# EAGLE design GrblPi B+ (EAGLE 6.4)
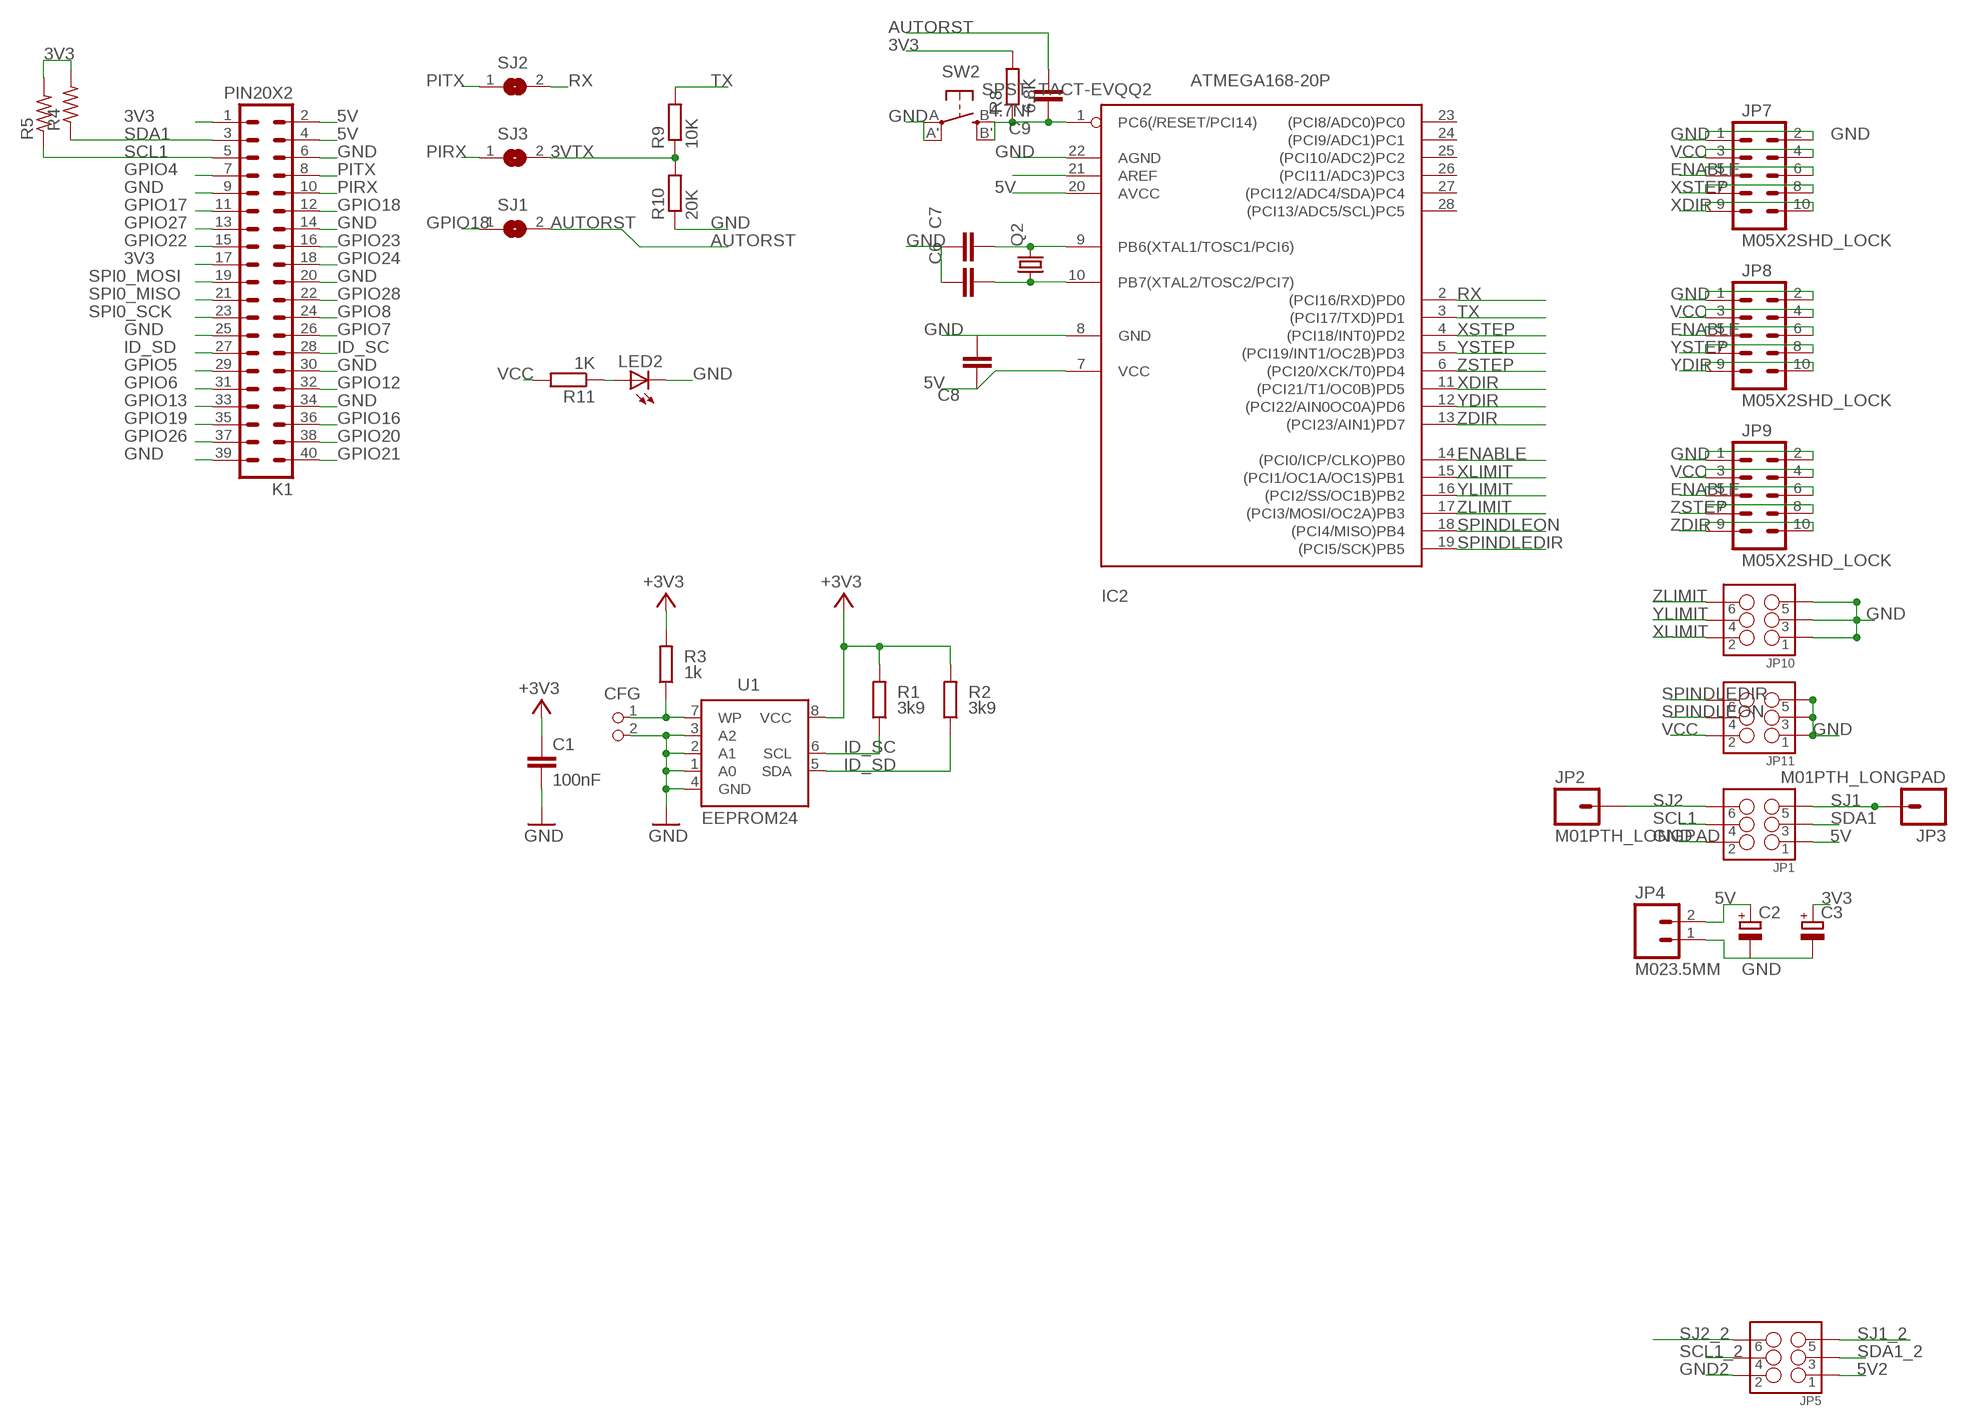
[diagram p0: schematic, sheet 1, part 1 of 2]
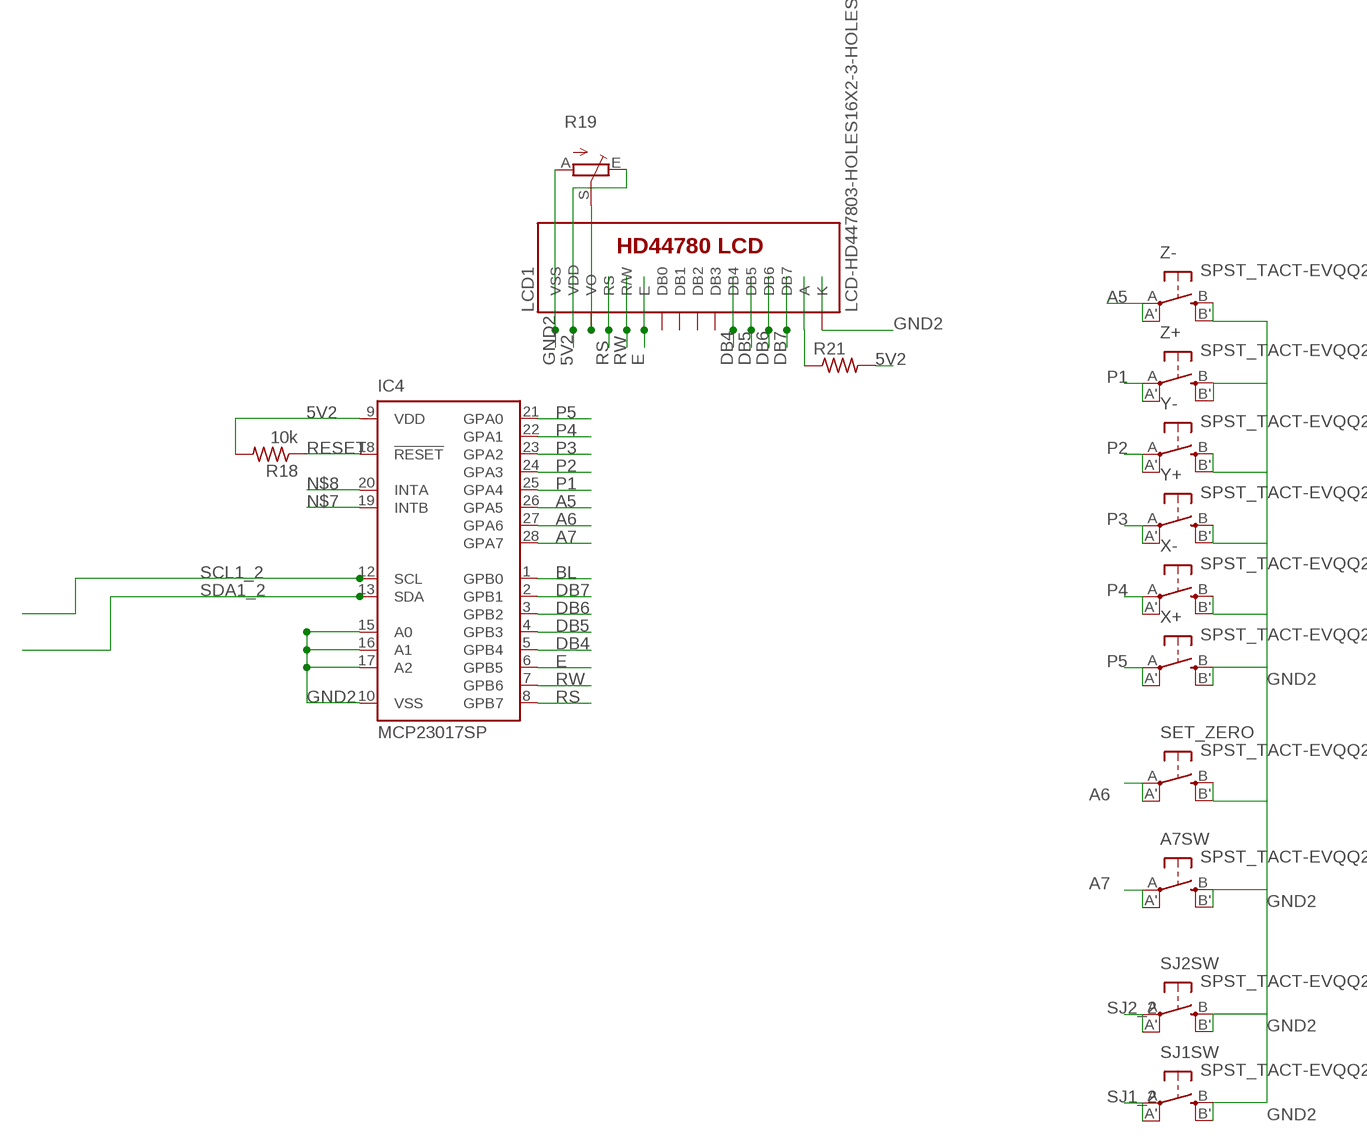
[diagram p1: schematic, sheet 1, part 2 of 2]

## Parts
A7SW  SPST_TACT-EVQQ2  [EVQ-Q2]
C1  100nF  C-EUC1206  [C1206]
C2  CPOL-EU153CLV-0405  [153CLV-0405]
C3  CPOL-EU153CLV-0405  [153CLV-0405]
C6  CAPACITOR_NPOL-1206  [C1206]
C7  CAPACITOR_NPOL-1206  [C1206]
C8  CAPACITOR_NPOL-1206  [C1206]
C9  4.7Nf  CAPACITOR_NPOL-1206  [C1206]
CFG  PIN2_100  [PIN_W_2]
IC2  ATMEGA168-20P  [DIL28-3]
IC4  MCP23017SP  [DIL28-3]
JP1  M03X2SHROUD  [2X3-SHROUDED]
JP2  M01PTH_LONGPAD  [1X01_LONGPAD]
JP3  M01PTH_LONGPAD  [1X01_LONGPAD]
JP4  M023.5MM  [SCREWTERMINAL-3.5MM-2]
JP5  M03X2SHROUD  [2X3-SHROUDED]
JP7  M05X2SHD_LOCK  [2X5-SHROUDED_LOCK]
JP8  M05X2SHD_LOCK  [2X5-SHROUDED_LOCK]
JP9  M05X2SHD_LOCK  [2X5-SHROUDED_LOCK]
JP10  M03X2SHROUD  [2X3-SHROUDED]
JP11  M03X2SHROUD  [2X3-SHROUDED]
K1  PIN20X2  [PIN_20X2]
LCD1  LCD-HD447803-HOLES16X2-3-HOLES  [LCD-16X2-3HOLES]
LED2  LEDCHIPLED_1206  [CHIPLED_1206]
Q2  CRYSTALHC49UP  [HC49UP]
R1  3k9  R-EU_M1206  [M1206]
R2  3k9  R-EU_M1206  [M1206]
R3  1k  R-EU_M1206  [M1206]
R4  R-US_M1206  [M1206]
R5  R-US_M1206  [M1206]
R8  6.8K  RESISTOR-1206  [R1206]
R9  10K  RESISTOR-1206  [R1206]
R10  20K  RESISTOR-1206  [R1206]
R11  1K  RESISTOR-1206  [R1206]
R18  10k  R-US_M1206  [M1206]
R19  TRIM_EU-CA6V  [CA6V]
R21  R-US_M1206  [M1206]
SET_ZERO  SPST_TACT-EVQQ2  [EVQ-Q2]
SJ1  SJ  [SJ]
SJ1SW  SPST_TACT-EVQQ2  [EVQ-Q2]
SJ2  SJ  [SJ]
SJ2SW  SPST_TACT-EVQQ2  [EVQ-Q2]
SJ3  SJ  [SJ]
SW2  SPST_TACT-EVQQ2  [EVQ-Q2]
U1  EEPROM24  [SOIC8]
X+  SPST_TACT-EVQQ2  [EVQ-Q2]
X-  SPST_TACT-EVQQ2  [EVQ-Q2]
Y+  SPST_TACT-EVQQ2  [EVQ-Q2]
Y-  SPST_TACT-EVQQ2  [EVQ-Q2]
Z+  SPST_TACT-EVQQ2  [EVQ-Q2]
Z-  SPST_TACT-EVQQ2  [EVQ-Q2]

## Nets
3V3: C3.+ K1.1 K1.17 R4.2 R5.2 R8.2
3VTX: R9.1 R10.2 SJ3.2
5V: C2.+ C8.1 IC2.7(VCC) IC2.20(AVCC) JP1.1 JP4.2 K1.2 K1.4
5V2: IC4.9(VDD) JP5.1 LCD1.2(VDD) R18.2 R19.E R21.2
+3V3: C1.1 R1.2 R2.2 R3.2 U1.8(VCC)
A5: IC4.26(GPA5) Z-.A'(P1) Z-.A(P)
A6: IC4.27(GPA6) SET_ZERO.A'(P1) SET_ZERO.A(P)
A7: A7SW.A'(P1) A7SW.A(P) IC4.28(GPA7)
AUTORST: C9.2 SJ1.2
BL: IC4.1(GPB0)
DB4: IC4.5(GPB4) LCD1.11(DB4)
DB5: IC4.4(GPB3) LCD1.12(DB5)
DB6: IC4.3(GPB2) LCD1.13(DB6)
DB7: IC4.2(GPB1) LCD1.14(DB7)
E: IC4.6(GPB5) LCD1.6(E)
ENABLE: IC2.14((PCI0/ICP/CLKO)PB0) JP7.5 JP7.6 JP8.5 JP8.6 JP9.5 JP9.6
GND: C1.2 C2.- C3.- C6.1 C7.1 C8.2 CFG.2 IC2.8(GND) IC2.22(AGND) JP1.2 JP4.1 JP7.1 JP7.2 JP8.1 JP8.2 JP9.1 JP9.2 JP10.1 JP10.3 JP10.5 JP11.1 JP11.3 JP11.5 K1.6 K1.9 K1.14 K1.20 K1.25 K1.30 K1.34 K1.39 LED2.C R10.1 SW2.A'(P1) SW2.A(P) U1.1(A0) U1.2(A1) U1.3(A2) U1.4(GND)
GND2: A7SW.B'(S1) A7SW.B(S) IC4.10(VSS) IC4.15(A0) IC4.16(A1) IC4.17(A2) JP5.2 LCD1.1(VSS) LCD1.16(K) R19.A SET_ZERO.B'(S1) SET_ZERO.B(S) SJ1SW.B'(S1) SJ1SW.B(S) SJ2SW.B'(S1) SJ2SW.B(S) X+.B'(S1) X+.B(S) X-.B'(S1) X-.B(S) Y+.B'(S1) Y+.B(S) Y-.B'(S1) Y-.B(S) Z+.B'(S1) Z+.B(S) Z-.B'(S1) Z-.B(S)
GPIO4: K1.7
GPIO5: K1.29
GPIO6: K1.31
GPIO7: K1.26
GPIO8: K1.24
GPIO12: K1.32
GPIO13: K1.33
GPIO16: K1.36
GPIO17: K1.11
GPIO18: K1.12 SJ1.1
GPIO19: K1.35
GPIO20: K1.38
GPIO21: K1.40
GPIO22: K1.15
GPIO23: K1.16
GPIO24: K1.18
GPIO26: K1.37
GPIO27: K1.13
GPIO28: K1.22
ID_SC: K1.28 R1.1 U1.6(SCL)
ID_SD: K1.27 R2.1 U1.5(SDA)
MCURESET1: C9.1 IC2.1(PC6(/RESET/PCI14)) R8.1 SW2.B'(S1) SW2.B(S)
N$3: CFG.1 R3.1 U1.7(WP)
N$7: IC4.19(INTB)
N$8: IC4.20(INTA)
N$11: LCD1.3(VO) R19.S
N$12: LCD1.15(A) R21.1
N$13: IC2.21(AREF)
N$14: LED2.A R11.1
P1: IC4.25(GPA4) Z+.A'(P1) Z+.A(P)
P2: IC4.24(GPA3) Y-.A'(P1) Y-.A(P)
P3: IC4.23(GPA2) Y+.A'(P1) Y+.A(P)
P4: IC4.22(GPA1) X-.A'(P1) X-.A(P)
P5: IC4.21(GPA0) X+.A'(P1) X+.A(P)
PIRX: K1.10 SJ3.1
PITX: K1.8 SJ2.1
RESET: IC4.18(!RESET) R18.1
RS: IC4.8(GPB7) LCD1.4(RS)
RW: IC4.7(GPB6) LCD1.5(R/W)
RX: IC2.2((PCI16/RXD)PD0) SJ2.2
SCL1: JP1.4 K1.5 R5.1
SCL1_2: IC4.12(SCL) JP5.4
SDA1: JP1.3 K1.3 R4.1
SDA1_2: IC4.13(SDA) JP5.3
SJ1: JP1.5 JP3.1
SJ1_2: JP5.5 SJ1SW.A'(P1) SJ1SW.A(P)
SJ2: JP1.6 JP2.1
SJ2_2: JP5.6 SJ2SW.A'(P1) SJ2SW.A(P)
SPI0_MISO: K1.21
SPI0_MOSI: K1.19
SPI0_SCK: K1.23
SPINDLEDIR: IC2.19((PCI5/SCK)PB5) JP11.6
SPINDLEON: IC2.18((PCI4/MISO)PB4) JP11.4
TX: IC2.3((PCI17/TXD)PD1) R9.2
VCC: JP7.3 JP7.4 JP8.3 JP8.4 JP9.3 JP9.4 JP11.2 R11.2
XDIR: IC2.11((PCI21/T1/OC0B)PD5) JP7.9 JP7.10
XLIMIT: IC2.15((PCI1/OC1A/OC1S)PB1) JP10.2
XSTEP: IC2.4((PCI18/INT0)PD2) JP7.7 JP7.8
XTAL3: C6.2 IC2.10(PB7(XTAL2/TOSC2/PCI7)) Q2.1
XTAL4: C7.2 IC2.9(PB6(XTAL1/TOSC1/PCI6)) Q2.2
YDIR: IC2.12((PCI22/AIN0OC0A)PD6) JP8.9 JP8.10
YLIMIT: IC2.16((PCI2/SS/OC1B)PB2) JP10.4
YSTEP: IC2.5((PCI19/INT1/OC2B)PD3) JP8.7 JP8.8
ZDIR: IC2.13((PCI23/AIN1)PD7) JP9.9 JP9.10
ZLIMIT: IC2.17((PCI3/MOSI/OC2A)PB3) JP10.6
ZSTEP: IC2.6((PCI20/XCK/T0)PD4) JP9.7 JP9.8
Unconnected: IC2.23((PCI8/ADC0)PC0) IC2.24((PCI9/ADC1)PC1) IC2.25((PCI10/ADC2)PC2) IC2.26((PCI11/ADC3)PC3) IC2.27((PCI12/ADC4/SDA)PC4) IC2.28((PCI13/ADC5/SCL)PC5) LCD1.7(DB0) LCD1.8(DB1) LCD1.9(DB2) LCD1.10(DB3)

## Library data of the parts
A7SW SET_ZERO SJ1SW SJ2SW SW2 X+ X- Y+ Y- Z+ Z- = adafruit:SPST_TACT: SMT 6mm switch, EVQQ2 series http://www.ladyada.net/library/eagle
C1 = resistor:C-EU: CAPACITOR, European symbol; DIELECTRIC: X7R
C2 C3 = rcl:CPOL-EU: POLARIZED CAPACITOR, European symbol
C6-C9 = dp_devices:CAPACITOR_NPOL: Non-Polarized capacitor in various packages
CFG = FLYFISH:PIN2
IC2 = adafruit:ATMEGA168*P: MICROCONTROLLER 16 kBytes FLASH 1 kBytes SRAM 512 Bytes EEPROM USART 8-channel 10 bit ADC
IC4 = adafruit:MCP23017: http://ww1.microchip.com/downloads/en/DeviceDoc/21952a.pdf Source: http://ww1.microchip.com/downloads/en/DeviceDoc/21952a.pdf
JP1 JP5 JP10 JP11 = SparkFun-Connectors:M03X2: 2x3 .1" header. Shrouded, with keying- CONN-10681 SMT- CONN-11415 Pogo pins- HW-11044; PROD_ID: CONN-10681
JP2 JP3 = SparkFun-Connectors:M01: Header 1 Standard 1-pin 0.1" header. Use with straight break away headers (SKU : PRT-00116), right angle break away headers (PRT-00553), swiss pins (PRT-00743), machine pins (PRT-00117), and female headers (PRT-00115).
JP4 = SparkFun-Connectors:M02: Standard 2-pin 0.1" header. Use with - straight break away headers ( PRT-00116) - right angle break away headers (PRT-00553) - swiss pins (PRT-00743) - machine pins (PRT-00117) - female headers (PRT-00115) Molex polarized connector foot print use with: PRT-08233 with associated crimp pins and housings. 2.54_SCREWTERM for use with PRT-10571. 3.5mm Screw Terminal footprints for PRT-08084 5mm Screw Terminal footprints for use with PRT-08433
JP7-JP9 = SparkFun-Connectors:M05X2: Header 5x2 Standard 10-pin dual row 0.1" header. Commonly used with AVR-ISP. Use with Spark Fun Electronics SKU: PRT-00778
K1 = FLYFISH:PIN20X2
LCD1 = HD44780LCD:LCD-HD44780
LED2 = adafruit:LED: LED OSRAM: - CHIPLED LG R971, LG N971, LY N971, LG Q971, LY Q971, LO R971, LY R971 LH N974, LH R974 LS Q976, LO Q976, LY Q976 LO Q996 - Hyper CHIPLED LW Q18S LB Q993, LB Q99A, LB R99A - SideLED LS A670, LO A670, LY A670, LG A670, LP A670 LB A673, LV A673, LT A673, LW A673 LH A674 LY A675 LS A676, LA A676, LO A676, LY A676, LW A676 LS A679, LY A679, LG A679 - Hyper Micro SIDELED® LS Y876, LA Y876, LO Y876, LY Y876 LT Y87S - SmartLED LW L88C, LW L88S LB L89C, LB L89S, LG L890 LS L89K, LO L89K, LY L89K LS L896, LA L896, LO L896, LY L896 - TOPLED LS T670, LO T670, LY T670, LG T670, LP T670 LSG T670, LSP T670, LSY T670, LOP T670, LYG T670 LG T671, LOG T671, LSG T671 LB T673, LV T673, LT T673, LW T673 LH T674 LS T676, LA T676, LO T676, LY T676, LB T676, LH T676, LSB T676, LW T676 LB T67C, LV T67C, LT T67C, LS T67K, LO T67K, LY T67K, LW E67C LS E67B, LA E67B, LO E67B, LY E67B, LB E67C, LV E67C, LT E67C LW T67C LS T679, LY T679, LG T679 LS T770, LO T770, LY T770, LG T770, LP T770 LB T773, LV T773, LT T773, LW T773 LH T774 LS E675, LA E675, LY E675, LS T675 LS T776, LA T776, LO T776, LY T776, LB T776 LHGB T686 LT T68C, LB T68C - Hyper Mini TOPLED® LB M676 - Mini TOPLED Santana® LG M470 LS M47K, LO M47K, LY M47K Source: http://www.osram.convergy.de/
Q2 = adafruit:CRYSTAL: CRYSTAL; OC_FARNELL: unknown; OC_NEWARK: unknown
R1-R3 = resistor:R-EU_: RESISTOR, European symbol; TOLERANCE: 5%
R4 R5 R18 R21 = adafruit:R-US_: RESISTOR, American symbol
R8-R11 = dp_devices:RESISTOR
R19 = pot:TRIM_EU-: POTENTIOMETER
SJ1-SJ3 = jumper:SJ: SMD solder JUMPER
U1 = FLYFISH:EEPROM24

## Board
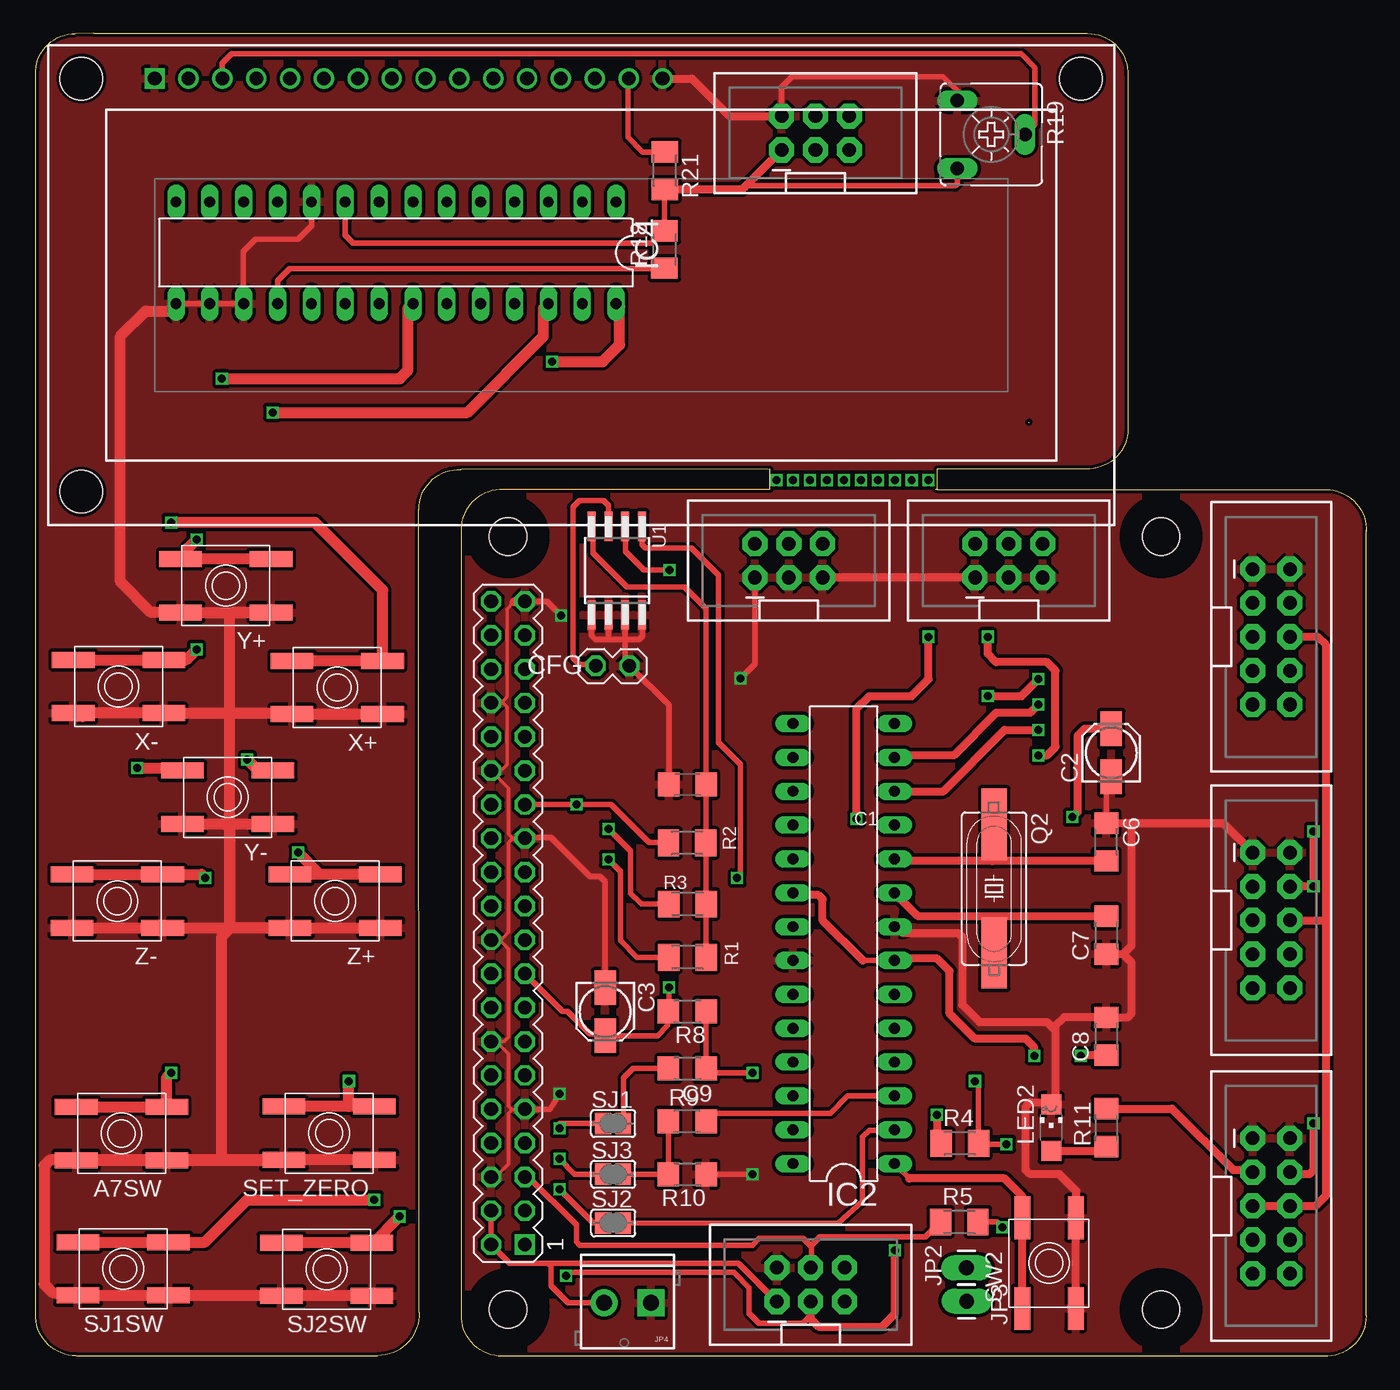
[diagram p2: board, top side]
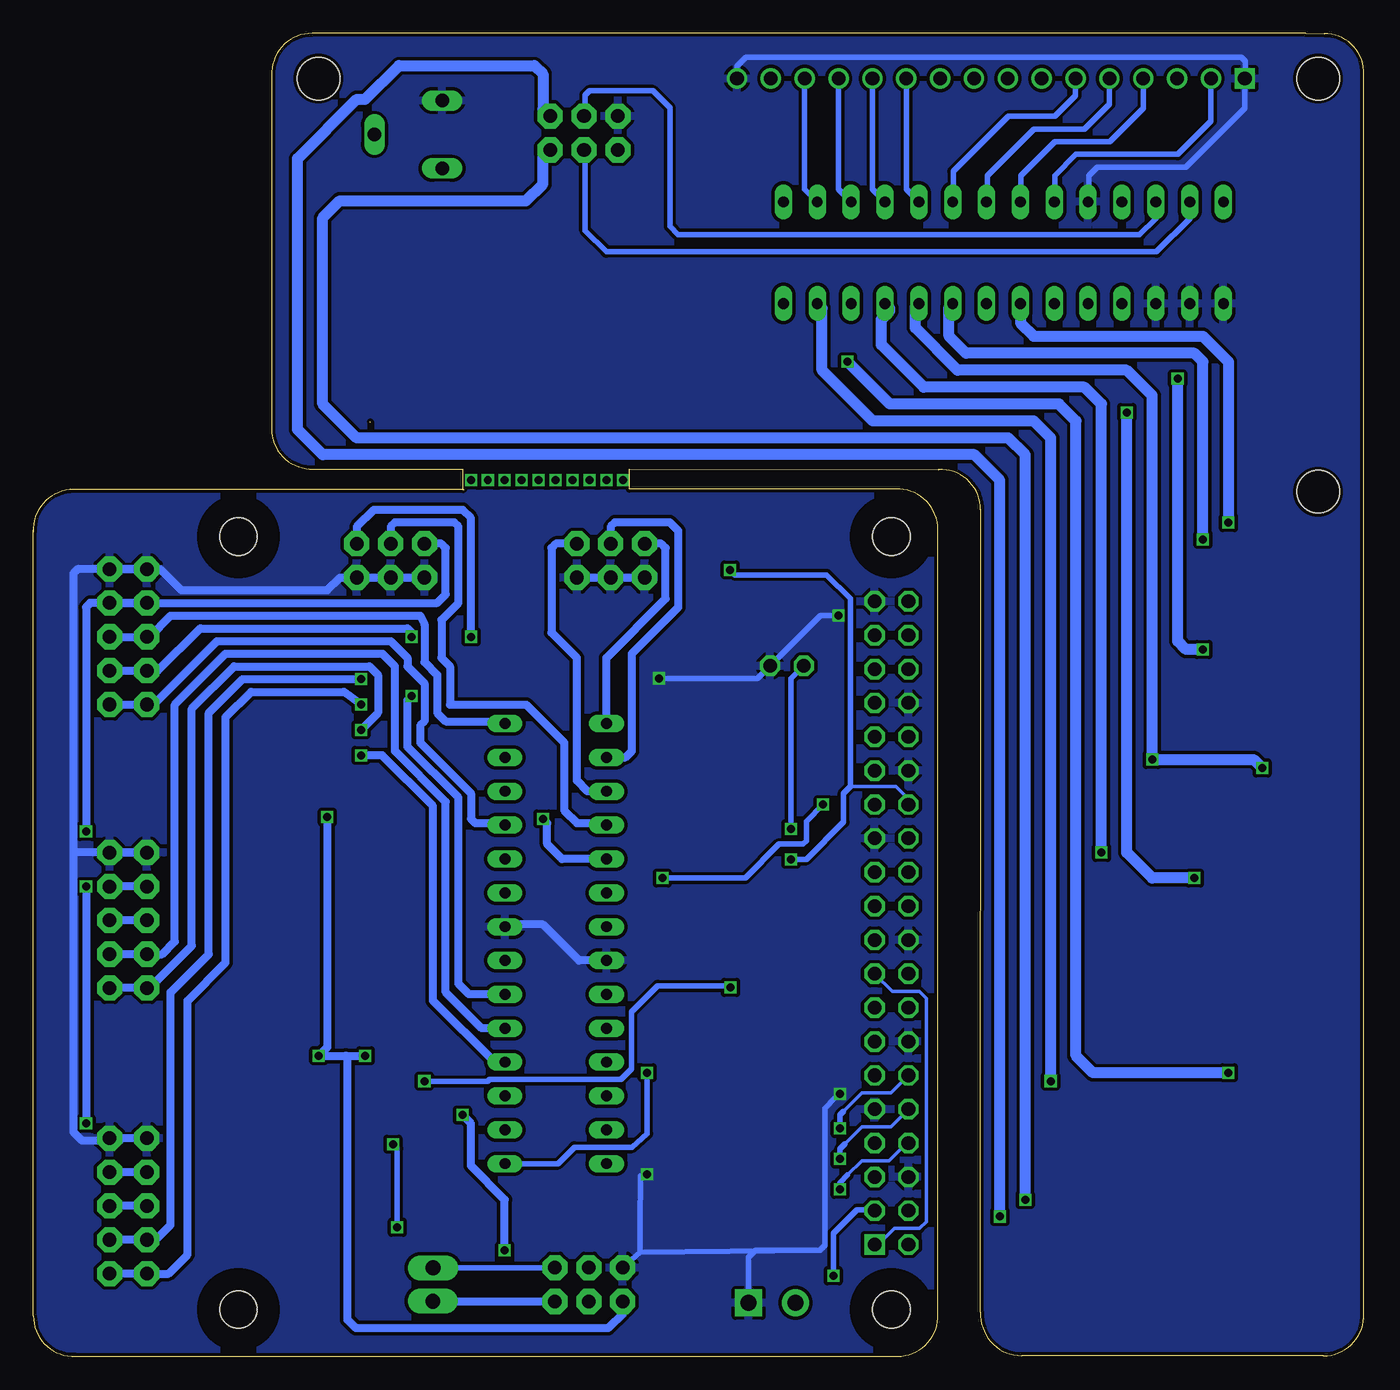
[diagram p3: board, bottom side, seen from below]

Size 99.82 x 99.25 mm. Coordinates in mm from the lower left corner, seen from the top.
Outline: 96.79,65.02 96.8,65.02 arc-93 99.82,61.85
Outline: 99.82,61.85 99.82,3.02 arc-93 96.67,0
Outline: 99.82,61.85 99.82,62
Outline: 96.83,0 96.67,0
Outline: 96.67,0 34.98,0
Outline: 34.98,0 34.92,0
Outline: 31.95,3.15 31.95,62.03 arc-93 35.1,65.05
Outline: 31.95,3 31.95,3.15
Outline: 34.98,0 arc-93 31.95,3.15
Outline: 3.02,0.04 arc-93 0,3.19
Outline: 0,3.18 0,96.18
Outline: 0,96.18 arc-93 2.97,99.23
Outline: 28.75,3.3 arc-93 25.67,0.04
Outline: 3.02,0.04 25.67,0.04
Outline: 28.76,3.29 28.75,63.52
Outline: 74.5,70.05 74.54,70.09
Outline: 4.36,99.25 2.97,99.23
Outline: 78.91,99.25 arc-93 81.93,96.09
Outline: 4.37,99.25 78.91,99.25
Outline: 78.91,99.25 78.91,99.25
Outline: 81.95,69.6 arc-93 78.79,66.57
Outline: 81.94,96.1 81.95,96.1 81.95,69.57
Outline: 78.75,66.57 67.62,66.57 67.62,65.02 67.51,65.02
Outline: 67.62,65.02 96.8,65.02 96.79,65.02
Outline: 35.11,65.05 55.09,65.05 55.09,66.55
Outline: 55.09,66.54 31.9,66.53 31.9,66.53
Outline: 28.75,63.51 arc-93 31.9,66.53
Copper layers (1*16): Top 0.035mm / dielectric 1.5mm / Bottom 0.035mm
Design rules "ITEADstudio_DRC *": minimum track width 6mil, minimum drill 12mil, track to track 10mil, track to pad 10mil, pad to pad 10mil, via to via 10mil, smd to smd 0mil, copper to edge 10mil, drill to drill 10mil, minimum pad ring 10mil, minimum via ring 6mil, stop-mask expansion 2mil, vias tented up to drill 100mil, thermal gap 10mil
Holes 2.8 mm at 84.44,3.5 35.44,3.5 35.44,61.5 84.44,61.5
tRestrict: area 33.9,2 to 37,5; area 33.9,60 to 37,63; area 82.9,60 to 86,63; area 82.9,2 to 86,5
bRestrict: area 82.9,2 to 86,5; area 33.9,2 to 37,5; area 82.9,60 to 86,63; area 33.9,60 to 37,63

### Footprints (pad centres in the part's own frame; a part is rotated, then mirrored left to right if it is on the bottom)
EVQ-Q2 = smd 3.2 x 1.2: A -3.4,-2; A' 3.4,-2; B -3.4,2; B' 3.4,2
C1206 = smd 1.6 x 1.8: 1 -1.4,0; 2 1.4,0
153CLV-0405 = smd 2.6 x 1.6: + 1.8,0; - -1.8,0
C1206' = smd 1.6 x 1.803: 1 -1.422,0; 2 1.422,0
PIN_W_2 = drill 1.016 octagon: 1 0,0; 2 0,-2.54
DIL28-3 = drill 0.813 long: 1 -16.51,-3.81; 2 -13.97,-3.81; 3 -11.43,-3.81; 4 -8.89,-3.81; 5 -6.35,-3.81; 6 -3.81,-3.81; 7 -1.27,-3.81; 8 1.27,-3.81; 9 3.81,-3.81; 10 6.35,-3.81; 11 8.89,-3.81; 12 11.43,-3.81; 13 13.97,-3.81; 14 16.51,-3.81; 15 16.51,3.81; 16 13.97,3.81; 17 11.43,3.81; 18 8.89,3.81; 19 6.35,3.81; 20 3.81,3.81; 21 1.27,3.81; 22 -1.27,3.81; 23 -3.81,3.81; 24 -6.35,3.81; 25 -8.89,3.81; 26 -11.43,3.81; 27 -13.97,3.81; 28 -16.51,3.81
2X3-SHROUDED = drill 1.016 pad 1.88 octagon: 1 -1.27,2.54; 2 1.27,2.54; 3 -1.27,0; 4 1.27,0; 5 -1.27,-2.54; 6 1.27,-2.54
1X01_LONGPAD = drill 1.118 pad 1.88 long: 1 0,0
SCREWTERMINAL-3.5MM-2 = drill 1.2 pad 2.032 square: 1 0,0 | drill 1.2 pad 2.032: 2 3.5,0
2X5-SHROUDED_LOCK = drill 1.016 pad 1.88 octagon: 1 -1.397,5.08; 2 1.397,5.08; 3 -1.397,2.54; 4 1.397,2.54; 5 -1.397,0; 6 1.397,0; 7 -1.397,-2.54; 8 1.397,-2.54; 9 -1.397,-5.08; 10 1.397,-5.08
PIN_20X2 = drill 1.016 square: 1 -24.13,-1.27 | drill 1.016 octagon: 2 -24.13,1.27; 3 -21.59,-1.27; 4 -21.59,1.27; 5 -19.05,-1.27; 6 -19.05,1.27; 7 -16.51,-1.27; 8 -16.51,1.27; 9 -13.97,-1.27; 10 -13.97,1.27; 11 -11.43,-1.27; 12 -11.43,1.27; 13 -8.89,-1.27; 14 -8.89,1.27; 15 -6.35,-1.27; 16 -6.35,1.27; 17 -3.81,-1.27; 18 -3.81,1.27; 19 -1.27,-1.27; 20 -1.27,1.27; 21 1.27,-1.27; 22 1.27,1.27; 23 3.81,-1.27; 24 3.81,1.27; 25 6.35,-1.27; 26 6.35,1.27; 27 8.89,-1.27; 28 8.89,1.27; 29 11.43,-1.27; 30 11.43,1.27; 31 13.97,-1.27; 32 13.97,1.27; 33 16.51,-1.27; 34 16.51,1.27; 35 19.05,-1.27; 36 19.05,1.27; 37 21.59,-1.27; 38 21.59,1.27; 39 24.13,-1.27; 40 24.13,1.27
LCD-16X2-3HOLES = drill 1.016 square: 1 -32,15.5 | drill 1.016: 2 -29.46,15.5; 3 -26.92,15.5; 4 -24.38,15.5; 5 -21.84,15.5; 6 -19.3,15.5; 7 -16.76,15.5; 8 -14.22,15.5; 9 -11.68,15.5; 10 -9.14,15.5; 11 -6.6,15.5; 12 -4.06,15.5; 13 -1.52,15.5; 14 1.02,15.5; 15 3.56,15.5; 16 6.1,15.5 | hole 3.2: -37.5,15.5; -37.5,-15.5; 37.5,15.5
CHIPLED_1206 = smd 1.5 x 1.5: A 0,-1.75; C 0,1.75
HC49UP = smd 5.334 x 1.93: 1 -4.826,0; 2 4.826,0
M1206 = smd 1.6 x 2: 1 -1.4,0; 2 1.4,0
R1206 = smd 1.6 x 1.803: 1 -1.422,0; 2 1.422,0
CA6V = drill 1.016 long: A -2.54,-2.54; E 2.54,-2.54; S 0,2.54
SJ = smd 1.168 x 1.6: 1 -0.762,0; 2 0.762,0
SOIC8 = smd 0.6 x 2.2: 1 -1.905,-3.33; 2 -0.635,-3.33; 3 0.635,-3.33; 4 1.905,-3.33; 5 1.905,3.33; 6 0.635,3.33; 7 -0.635,3.33; 8 -1.905,3.33

### Placement (x,y rotation side)
A7SW  6.44,16.71 180 top
C1  48.91,42.91 180 top
C2  80.7,45.28 90 top
C3  42.72,25.84 270 top
C6  [C1206']  80.31,38.58 270 top
C7  [C1206']  80.31,31.59 90 top
C8  [C1206']  80.31,24 90 top
C9  4.7Nf  [C1206']  48.88,21.59 180 top
CFG  42.01,51.8 90 top
IC2  60.63,30.96 90 top
IC4  27.04,82.79 180 top
JP1  58.14,5.37 90 top
JP2  69.83,6.62 90 top
JP3  69.85,4.13 270 top
JP4  46.15,4 180 top
JP5  58.5,91.77 90 top
JP7  92.7,53.97 0 top
JP8  92.7,32.7 0 top
JP9  92.7,11.27 0 top
JP10  56.5,59.69 90 top
JP11  73.01,59.69 90 top
K1  35.44,32.5 90 top
LCD1  40.93,80.36 0 top
LED2  76.19,17.14 0 top
Q2  71.9,35.08 270 top
R1  48.9,29.93 0 top
R2  48.88,38.51 0 top
R3  48.9,33.93 0 top
R4  69.34,15.97 0 top
R5  69.29,10.07 0 top
R8  48.88,25.88 180 top
R9  48.88,17.62 0 top
R10  48.88,13.65 180 top
R11  80.31,17.14 90 top
R18  47.17,83.03 90 top
R19  71.69,91.67 270 top
R21  47.21,88.95 270 top
SET_ZERO  22.02,16.73 180 top
SJ1  43.33,17.46 0 top
SJ1SW  6.57,6.55 180 top
SJ2  43.33,10 0 top
SJ2SW  21.83,6.53 180 top
SJ3  43.33,13.65 0 top
SW2  76.03,6.99 90 top
U1  43.6,58.94 0 top
X+  22.63,50.17 180 top
X-  6.21,50.25 180 top
Y+  14.27,57.81 180 top
Y-  14.4,41.93 180 top
Z+  22.47,34.15 180 top
Z-  6.13,34.15 180 top

### Tracks (layer width: path | path; a pad name or v marks a point on that pad's centre or on a via)
3V3  (via drill 0.6)
  Top 0.406: K1.17 39.52,25.88 39.9,25.88 41.58,24.19 42.57,24.19 C3.+ 46.64,24.04 47.42,24.83 47.42,25.84 R8.2 47.51,25.93 v47.51,27.67 | v72.84,15.9 70.81,15.9 R4.2 70.74,20.38 v70.48,20.64 | R5.2 72.11,10.07 v72.52,9.67
  Bottom 0.254: K1.1 36.45,8.37 35.23,9.59 33.33,9.59 32.82,10.1 32.82,26.86 33.33,27.37 35.38,27.37 K1.17
  Bottom 0.406: 72.47,9.82 72.52,9.54 v72.52,9.67 72.52,15.57 v72.84,15.9 | v70.48,20.64 65.74,20.64 65.61,20.77 55.72,20.77 54.93,21.55 54.93,25.85 52.98,27.8 47.64,27.8 v47.51,27.67
3VTX
  Top 0.406: SJ3.2 R10.2 R9.1
5V  (via drill 0.6)
  Top 0.254: K1.2
  Top 0.406: K1.4 K1.2 | K1.2 35.55,6.99 38.41,6.99 | 38.41,6.99 52.72,6.99 | 52.72,6.99 JP1.1 | JP4.2 39.93,4 38.66,5.27 38.66,6.73 38.41,6.99 | IC2.7 62.06,29.69 | 52.72,6.99 52.72,6.96 v55.55,4.13
  Top 0.61: C8.1 78.45,22.58 v78.41,22.54 | v74.92,22.54 74.92,23.18 74.28,23.81 70.47,23.81 68.57,25.72 68.57,28.89 67.61,29.85 64.6,29.85 IC2.7 | 62.06,29.69 59.04,32.7 59.04,34.29 58.73,34.61 56.98,34.61 IC2.20 | C2.+ 78.69,47.08 78.16,46.55 78.16,40.83 v77.78,40.45
  Bottom 0.61: 76.38,22.54 v78.41,22.54 77.78,23.18 v77.78,40.45 | 76.38,22.54 v74.92,22.54 | v55.55,4.13 55.55,3.24 56.69,2.1 75.62,2.1 76.25,2.73 76.25,22.42 76.38,22.54
5V2
  Top 0.406: R21.2 47.17,87.51 R18.2 46.24,83.5 23.81,83.5 23.23,84.09 IC4.9 | R19.E 69.15,87.97 68.99,87.81 53.27,87.81 53.26,87.79
  Top 0.61: R21.2 53.01,87.55 53.26,87.79 JP5.1
  Bottom 0.406: LCD1.2 11.47,92.67 13.97,90.17 21.59,90.17 23.18,88.58 23.18,86.65 IC4.9
+3V3
  Top 0.406: R1.2 R3.2 50.28,33.95 R2.2 50.31,38.54 C1.1 50.31,56.11 48.69,57.72 44.37,57.72 41.83,60.26 41.83,62.13 U1.8
A5  (via drill 0.6)
  Top 0.813: Z-.A' Z-.A 12.43,36.15 v12.7,35.88 | IC4.26 38.1,78.62 38.1,76.52 32.38,70.8 v17.78,70.8
  Bottom 0.813: v12.7,35.88 15.88,35.88 17.78,37.78 v17.78,70.8
A6  (via drill 0.6)
  Top 0.813: 23.5,18.73 SET_ZERO.A' | SET_ZERO.A 23.5,18.73 | 23.5,18.73 v23.5,20.64
  Bottom 0.813: v23.5,20.64 23.5,68.9 24.77,70.17 36.83,70.17 40.64,73.98 40.64,78.62 IC4.27
A7  (via drill 0.6)
  Top 0.813: A7SW.A' A7SW.A 9.84,20.95 v10.16,21.27 | v38.73,74.61 42.55,74.61 43.81,75.88 43.81,78.71 IC4.28
  Bottom 0.813: v10.16,21.27 20.32,21.27 21.59,22.54 21.59,70.17 22.86,71.44 35.56,71.44 v38.73,74.61
AUTORST
  Top 0.406: C9.2 44.82,21.59 44.12,20.89 44.12,17.49 SJ1.2
DB4
  Bottom 0.406: LCD1.11 34.33,87.54 IC4.5
DB5
  Bottom 0.406: LCD1.12 36.87,87.54 IC4.4
DB6
  Bottom 0.406: LCD1.13 39.41,87.54 IC4.3
DB7
  Bottom 0.406: LCD1.14 41.95,87.54 IC4.2
E
  Bottom 0.406: LCD1.6 21.63,94.58 23.18,93.03 26.67,93.03 30.8,88.9 30.8,86.65 IC4.6
ENABLE
  Top 0.61: JP9.5 96.03,11.27 96.83,12.07 96.83,32.7 | 96.83,32.7 96.83,53.34 96.19,53.97 JP7.6 | JP8.6 96.83,32.7
  Bottom 0.61: JP9.5 JP9.6 | JP8.5 JP8.6 | JP7.6 JP7.5 91.11,53.97 89.52,55.56 70.79,55.56 70.47,54.93 70.47,52.07 69.52,51.12 69.52,48.26 68.89,47.63 64.6,47.63 IC2.14
GND  (via drill 0.6)
  Top 0.254: K1.6 34.52,13.45 35.48,14.41 35.48,18.22 35.74,18.48 | 35.74,18.48 36.65,18.48 K1.9 | 35.74,18.48 35.48,18.73 35.48,22.67 34.54,23.61 K1.14 35.15,23.61 35.48,23.94 35.48,30.54 34.8,31.23 K1.20 34.9,31.23 35.48,31.81 35.48,38.54 35.74,38.8 36.65,38.8 K1.25 35.81,38.85 35.48,39.18 35.48,42.61 K1.30 34.9,43.93 35.36,44.39 35.36,48.7 34.98,49.09 34.24,49.09 K1.34 34.9,49.01 35.36,49.47 35.36,56.07 35.87,56.58
  Top 0.406: K1.9 38.58,18.53 v39.29,19.69 | v53.77,13.65 R10.1 | 44.23,53.78 U1.3 44.23,54.18 44.25,53.78 45.26,53.78 45.52,54.04 45.52,55.6 U1.4 | 44.23,53.78 44.23,52.11 CFG.2 47.51,48.84 C1.2 | JP10.1 53.96,51.94 v52.88,50.86 | U1.1 41.69,54.05 41.96,53.78 42.98,53.78 | 42.98,53.78 42.98,55.6 U1.2 42.96,54.18 42.98,53.78 | 42.98,53.78 44.23,53.78 | K1.39 38.35,56.63 v39.42,55.56 | C3.- 42.72,35.62 42.34,36 41.58,36 38.66,38.93 36.78,38.93 K1.25 | C6.1 80.31,43.09 C2.-
  Top 0.61: JP8.1 89.08,40 C6.1 81.91,40 82.22,39.69 82.22,30.8 81.58,30.16 80.32,30.16 C7.1 81.58,30.17 82.22,29.53 82.22,25.72 81.9,25.4 80.34,25.4 C8.2 77.17,25.42 76.5,24.76 76.5,24.45 | 76.5,24.45 76.5,19.21 LED2.C 76.03,19.05 74.6,19.05 74.28,18.73 74.28,13.97 74.6,13.65 76.82,13.65 78.09,12.38 78.09,10.8 78.03,10.73 SW2.A' SW2.A | IC2.8 64.6,32.23 65.08,31.75 69.2,31.75 69.52,31.43 69.52,26.35 70.79,25.08 75.87,25.08 76.5,24.45 | JP11.1 JP10.5 | K1.39 35.92,56.63 35.87,56.58
  Bottom 0.406: v39.29,19.69 39.67,19.37 40.44,18.61 40.44,8.32 40.82,7.94 | 40.82,7.94 54.3,7.81 | 54.3,7.81 JP1.2 | 54.3,7.81 54.3,9.87 54.28,13.53 53.9,13.65 v53.77,13.65 | v52.88,50.86 45.48,50.86 CFG.2 40.78,55.56 v39.42,55.56 | 40.82,7.94 45.64,7.94 46.15,7.43 JP4.1
  Bottom 0.61: JP9.1 93.17,16.35 93.33,16.19 93.94,16.19 JP9.2 94.25,16.19 96.19,16.19 96.83,16.83 96.83,37.78 | JP8.2 JP8.1 96.83,37.78 | JP7.2 JP7.1 | JP7.1 96.51,59.06 96.83,58.74 96.83,37.78 | JP7.1 90.3,59.06 88.71,57.47 77.78,57.47 76.82,58.42 JP11.5 JP11.3 JP11.1 | IC2.22 58.88,29.69 61.58,32.39 64.28,32.39 IC2.8 | JP10.5 JP10.3 JP10.1
  pour Bottom: 32.38,65.72 99.06,65.72 101.28,63.5 101.28,1.59 98.74,-0.95 33.66,-0.95 30.8,1.91 30.8,64.14
  pour Top: 32.07,65.72 98.74,65.72 100.65,63.82 100.65,1.27 98.42,-0.95 33.02,-0.95 30.8,1.27 30.8,64.45
GND2
  Top 0.406: IC4.10 20.69,84.82 19.68,83.82 16.51,83.82 15.56,82.87 15.56,79.03 IC4.17 IC4.16 IC4.15 | JP5.2 55.96,95.22 56.76,96.01 68.08,96.01 69.38,94.71 69.38,94.44 R19.A
  Top 0.61: LCD1.16 49.24,95.86 52.07,93.03 55.95,93.03 JP5.2
  Top 0.813: SJ2SW.B' 9.96,4.53 | 9.96,4.53 3.2,4.53 SJ1SW.B' 2.96,4.76 1.27,4.76 0.64,5.4 0.64,14.29 1.08,14.73 SET_ZERO.B' | 9.96,4.53 9.97,4.53 SJ1SW.B 25.21,4.55 SJ2SW.B | A7SW.B' A7SW.B 18.6,14.71 SET_ZERO.B' | Z-.B' Z-.B 14.34,32.15 | 14.34,32.15 14.61,32.15 | 14.61,32.15 Z+.B' | Z+.B' Z+.B | Y-.B' 14.61,39.93 | 14.61,39.93 Y-.B | X+.B X+.B' 19.16,48.25 X-.B | 14.52,48.3 14.52,55.49 14.85,55.81 Y+.B Y+.B' 8.64,55.81 6.35,58.1 6.35,76.52 8.26,78.42 9.96,78.42 IC4.15 | 14.52,48.3 14.52,32.32 14.34,32.15 | X-.B 3.78,48.25 3.52,47.99 3.07,47.99 X-.B' | X-.B 14.47,48.25 14.52,48.3 | SET_ZERO.B SET_ZERO.B' | SET_ZERO.B' 14.16,14.73 13.97,14.92 13.97,31.51 14.61,32.15 | Z+.B' 14.69,32.15 14.61,32.07 14.61,39.93
  Bottom 0.406: IC4.10 20.64,86.65 20.64,88.58 20,89.22 13.34,89.22 8.93,93.63 LCD1.1 8.89,95.9 8.89,97.15 9.21,97.47 46.35,97.47 47.03,96.8 LCD1.16
  pour Top: -1.27,100.01 81.28,100.01 82.55,98.74 82.55,67.63 81.28,66.36 32.07,66.36 29.84,64.14 29.84,0 28.26,-1.59 0.64,-1.59 -1.27,0.32
  pour Bottom: 0,101.28 80.01,101.28 83.5,97.79 83.5,68.58 80.96,66.04 31.11,66.04 29.53,64.45 29.53,0.32 27.94,-1.27 0.64,-1.27 -0.95,0.32 -0.95,100.33
GPIO18  (via drill 0.6)
  Top 0.406: SJ1.1 39.29,17.46 v39.29,17.08
  Bottom 0.254: K1.12 35.48,19.75 37.64,19.75 39.04,18.35
  Bottom 0.406: v39.29,17.08 39.29,18.1 39.04,18.35
ID_SC  (via drill 0.6)
  Top 0.406: R1.1 45.12,29.93 43.87,31.18 43.87,36.39 v42.98,37.27 | v47.55,58.99 45.64,58.99 44.25,60.39 44.25,62.26 U1.6
  Bottom 0.254: K1.28 34.16,41.8 35.1,42.74 38.53,42.74
  Bottom 0.406: v42.98,37.27 41.83,37.27 39.04,40.07 39.04,42.23 38.53,42.74 38.53,56.83 40.31,58.61 47.17,58.61 v47.55,58.99
ID_SD  (via drill 0.6)
  Top 0.406: K1.27 v40.56,41.39 43.18,41.39 46.02,38.54 47.45,38.54 R2.1 | U1.5 45.5,60.91 45.77,60.64 49.2,60.64 51.23,58.61 51.23,46.04 52.88,44.39 52.88,36.13 v52.63,35.88
  Bottom 0.406: v52.63,35.88 46.41,35.88 43.87,38.42 42.09,38.42 41.83,38.67 41.83,40.12 v40.56,41.39
MCURESET1  (via drill 0.6)
  Top 0.406: R8.1 C9.1 50.62,21.27 v53.77,21.27 | 65.55,13.33 IC2.1
  Top 0.61: SW2.B SW2.B' 74.03,12 72.69,13.33 65.55,13.33
  Bottom 0.406: IC2.1 60.47,14.45 59.23,15.68 54.91,15.68 53.77,16.7 v53.77,21.27
N$1
  Top 0.61: 42.5,10.18 44,10.18
N$2
  Top 0.61: 42.5,13.68 44,13.68
N$3  (via drill 0.6)
  Top 0.406: R3.1 45.44,33.93 44.63,34.73 44.63,37.91 v42.98,39.56 | U1.7 42.96,63.83 42.6,64.2 40.82,64.2 40.31,63.69 40.31,52.39 40.82,51.88 41.93,51.88 CFG.1
  Bottom 0.406: v42.98,39.56 42.98,50.83 CFG.1
N$4
  Top 0.61: 42.5,17.68 44,17.68
N$5  (via drill 0.6)
  other vias: 55.56,65.72
N$6  (via drill 0.6)
  other vias: 56.83,65.72
N$9  (via drill 0.6)
  other vias: 58.1,65.72
N$10  (via drill 0.6)
  other vias: 59.37,65.72
N$11
  Top 0.406: LCD1.3 14.01,97 14.71,97.7 73.94,97.7 74.98,96.66 74.98,92.42 R19.S
N$12
  Top 0.406: R21.1 45.54,90.35 44.45,91.44 44.45,95.82 LCD1.15
N$14
  Top 0.61: LED2.A 79.99,15.4 R11.1
N$15  (via drill 0.6)
  other vias: 60.64,65.72
N$16  (via drill 0.6)
  other vias: 61.91,65.72
N$17  (via drill 0.6)
  other vias: 63.18,65.72
N$18  (via drill 0.6)
  other vias: 64.45,65.72
N$19  (via drill 0.6)
  other vias: 65.72,65.72
N$20  (via drill 0.6)
  other vias: 66.99,65.72
P1  (via drill 0.6)
  Top 0.813: 21.32,36.15 Z+.A' | Z+.A 21.32,36.15 | 21.32,36.15 v19.68,37.78
  Bottom 0.813: v19.68,37.78 19.68,71.44 20.95,72.71 33.02,72.71 36.2,75.88 36.2,77.79 35.56,78.42 35.56,78.62 IC4.25
P2  (via drill 0.6)
  Top 0.813: Y-.A 16.71,43.93 v15.88,44.77 | v7.62,44.13 10.8,44.13 Y-.A'
  Bottom 0.813: v7.62,44.13 8.26,44.77 v15.88,44.77 15.88,72.07 17.78,73.98 30.48,73.98 33.66,77.15 33.66,78.71 IC4.24
P3  (via drill 0.6)
  Top 0.813: Y+.A' Y+.A 11.62,59.81 11.43,60.01 11.43,60.64 v12.06,61.28
  Bottom 0.813: v12.06,61.28 12.06,74.61 12.7,75.25 29.84,75.25 31.11,76.52 31.11,78.71 IC4.23
P4  (via drill 0.6)
  Top 0.813: X-.A' X-.A 11.29,52.25 v12.06,53.02 | v13.97,73.34 27.3,73.34 27.94,73.98 27.94,78.62 IC4.22
  Bottom 0.813: v12.06,53.02 13.34,53.02 13.97,53.66 v13.97,73.34
P5  (via drill 0.6)
  Top 0.813: X+.A' X+.A 26.03,57.47 20.95,62.55 v10.16,62.55
  Bottom 0.813: IC4.21 25.77,77.52 24.77,76.52 12.06,76.52 10.16,74.61 v10.16,62.55
PIRX  (via drill 0.6)
  Top 0.406: SJ3.1 40.44,13.65 v39.29,14.8
  Bottom 0.254: K1.10 35.48,17.21 37.64,17.21 38.91,15.94
  Bottom 0.406: v39.29,14.8 39.29,15.56 38.91,15.94
PITX  (via drill 0.6)
  Top 0.406: SJ2.1 41.8,10 v39.29,12.51
  Bottom 0.254: K1.8 34.29,15.99 35.61,14.67 37.64,14.67 38.72,13.59 38.91,13.4
  Bottom 0.406: v39.29,12.51 39.29,13.02 38.72,13.59
RESET
  Top 0.406: IC4.18 18.15,80.69 19.05,81.6 47.14,81.6 R18.1
RS
  Bottom 0.406: LCD1.4 16.55,93.63 19.05,91.12 23.18,91.12 25.72,88.58 25.72,86.65 IC4.8
RW
  Bottom 0.406: LCD1.5 19.09,93.94 20.95,92.07 24.77,92.07 28.26,88.58 28.26,86.65 IC4.7
RX
  Top 0.406: SJ2.2 60.19,9.98 62.03,11.62 62.03,16.45 62.53,16.95 64.41,16.95 IC2.2
SCL1
  Top 0.406: K1.5 36.96,13.45 40.56,9.84 40.56,8.57 40.82,8.32 53.77,8.32 54.28,8.83 57.58,8.83 58.22,8.19 | 58.22,8.19 58.22,6.72 JP1.4 | 58.22,8.19 58.22,8.33 58.83,8.95 66.76,8.95 R5.1
SCL1_2
  Bottom 0.406: IC4.12 15.61,85.36 16.83,84.14 51.44,84.14 52.07,84.77 52.07,93.66 53.34,94.93 58.1,94.93 58.42,94.62 58.42,93.12 JP5.4
SDA1  (via drill 0.6)
  Top 0.406: JP1.3 58.14,3.04 57.58,2.48 54.28,2.48 53.52,3.24 53.52,5.14 52.38,6.29 40.06,6.29 v39.8,6.03
  Top 0.61: JP1.3 58.14,2.82 58.74,2.22 63.5,2.22 64.45,3.18 v64.45,7.94 | v67.63,18.1 67.63,16.29 R4.1
  Bottom 0.406: v39.8,6.03 39.8,9.21 38.02,10.99 36.78,10.99 K1.3
  Bottom 0.61: v64.45,7.94 64.45,11.75 66.99,14.29 66.99,17.46 v67.63,18.1
SDA1_2
  Bottom 0.406: IC4.13 13.07,85.36 15.56,82.87 56.83,82.87 58.42,84.45 58.42,90.42 JP5.3
SJ1
  Bottom 0.61: JP1.5 69.82,4.1 JP3.1
SJ1_2  (via drill 0.6)
  Top 0.813: SJ1SW.A' SJ1SW.A 12.68,8.55 15.88,11.75 v25.4,11.75
  Bottom 0.813: v25.4,11.75 25.4,67.63 26.67,68.9 75.56,68.9 78.11,71.44 78.11,85.41 76.83,86.68 62.87,86.68 61.59,87.95 61.59,89.95 JP5.5
SJ2
  Bottom 0.406: JP1.6 69.81,6.64 JP2.1
SJ2_2  (via drill 0.6)
  Top 0.813: SJ2SW.A' SJ2SW.A 25.35,8.53 v27.3,10.48
  Bottom 0.813: v27.3,10.48 27.3,65.72 29.21,67.63 78.11,67.63 80.01,69.53 80.01,89.85 75.56,94.3 74.93,94.3 72.39,96.84 62.23,96.84 61.59,96.2 61.59,93.59 JP5.6
SPINDLEDIR  (via drill 0.6)
  Top 0.61: v61.58,40.32 61.58,48.58 62.53,49.53 65.71,49.53 66.98,50.8 v66.98,53.97
  Bottom 0.61: IC2.19 60.15,37.31 61.27,38.42 61.27,40 v61.58,40.32 | JP11.6 75.55,62.23 74.28,63.5 67.61,63.5 66.98,62.86 v66.98,53.97
SPINDLEON
  Bottom 0.61: IC2.18 56.98,40 59.04,40 59.99,40.96 59.99,46.04 62.85,48.89 68.57,48.89 68.57,51.75 69.2,52.39 69.2,55.24 67.93,56.52 67.93,62.23 68.25,62.55 72.69,62.55 73.01,62.23 JP11.4
TX
  Top 0.406: IC2.3 60.92,19.53 59.61,18.22 50.91,18.22 R9.2
VCC  (via drill 0.6)
  Top 0.61: v95.87,39.37 v95.87,35.24 JP8.4 | v95.87,17.46 95.87,13.97 95.56,13.65 94.25,13.65 JP9.4 | R11.2 85.24,18.57 89.84,13.97 91.14,13.97 JP9.3
  Bottom 0.61: JP9.3 JP9.4 | JP8.3 JP8.4 | JP7.4 JP7.3 | JP7.3 95.56,56.52 95.87,56.2 v95.87,39.37 | v95.87,35.24 v95.87,17.46 | JP7.3 69.52,56.52 68.89,57.15 68.89,60.64 69.2,60.96 JP11.2
XDIR
  Bottom 0.61: JP7.10 JP7.9 90.79,48.89 86.03,53.66 73.01,53.66 71.74,52.39 71.74,51.75 70.47,50.48 70.47,47.63 70.79,47.31 70.79,46.04 66.98,42.23 66.98,40.32 66.66,40 64.6,40 IC2.11
XLIMIT
  Bottom 0.61: IC2.15 56.82,52.39 52.38,56.83 52.38,60.64 52.69,60.96 JP10.2
XSTEP  (via drill 0.6)
  Top 0.61: v75.23,45.09 75.87,45.09 76.5,45.72 76.5,51.43 75.87,52.07 72.06,52.07 71.42,52.71 v71.42,53.97
  Bottom 0.61: JP7.8 JP7.7 90.47,51.43 87.3,54.61 71.74,54.61 71.42,54.29 v71.42,53.97 | IC2.4 65.23,22.07 69.84,26.67 69.84,41.28 73.65,45.09 v75.23,45.09
XTAL3
  Top 0.61: C6.2 71.74,37.15 | 71.74,37.15 64.59,37.15 IC2.10 | Q2.1 71.9,37.31 71.74,37.15
XTAL4
  Top 0.61: C7.2 71.74,33.01 | 71.74,33.01 66.19,33.01 IC2.9 | Q2.2 71.9,32.85 71.74,33.01
YDIR  (via drill 0.6)
  Top 0.61: IC2.12 68.09,42.39 72.69,46.99 v75.23,46.99
  Bottom 0.61: JP8.10 JP8.9 91.11,27.62 87.94,30.8 87.94,48.58 84.76,51.75 74.6,51.75 73.97,51.12 73.97,48.26 v75.23,46.99
YLIMIT
  Bottom 0.61: IC2.16 55.39,44.93 54.91,45.4 54.91,52.71 51.42,56.2 51.42,61.91 52.06,62.55 56.19,62.55 56.5,62.23 JP10.4
YSTEP
  Bottom 0.61: JP8.8 JP8.7 90.16,30.16 89.2,31.12 89.2,48.89 85.39,52.71 73.65,52.71 72.69,51.75 72.69,45.4 68.89,41.59 68.89,27.3 66.19,24.61 IC2.5
ZDIR  (via drill 0.6)
  Top 0.61: v75.23,48.89 74.6,48.26 72.06,48.26 68.89,45.09 64.6,45.09 IC2.13
  Bottom 0.61: JP9.10 JP9.9 89.68,6.19 88.25,7.62 88.25,26.67 85.39,29.53 85.39,47.94 83.49,49.85 76.5,49.85 v75.23,48.89
ZLIMIT
  Bottom 0.61: IC2.17 58.25,42.39 59.04,43.18 59.04,52.39 60.95,54.29 60.95,60.64 60.63,60.96 JP10.6
ZSTEP  (via drill 0.6)
  Top 0.61: v71.42,49.53 73.97,49.53 v75.23,50.8
  Bottom 0.61: JP9.8 JP9.7 90.63,8.73 89.52,9.84 89.52,27.3 86.67,30.16 86.67,48.26 84.12,50.8 v75.23,50.8 | IC2.6 67.14,27.15 67.93,27.94 67.93,41.91 71.74,45.72 71.74,49.21 v71.42,49.53

### Text on the board
OHSILK: LCD | RLED | 10k | Credits | SOFTWARE: | http://andrewhodel.github.io/grblweb | HARDWARE: | http://wiki.openhardware.co.za | FIRMWARE: | https://github.com/grbl/grbl | CAM: | https://github.com/tbfleming/jscut | GrblPi - Handheld CNC Control | ID B+ | EEPROM | Y+ | ENDSTOPS | SPINDLE | ID | X- | X+ | X-DRIVER | + | Y- | 10U | + | 0.1U | 3K9 | 22P | 1K | Z- | Z+ | GrblPi | 3K9 | 16Mhz | 22P | 10U | GrblPi | + | 6K8 | Y-DRIVER | SET | + | 4N7 | KILL | 0.1U | ZERO | 10K | 3K9 | 22K | Wiring Instructions: wiki.openhardware.co.za | 1K | POWER | + | 3K9 | Software: http://andrewhodel.github.io/grblweb/ | PROG1 | PROG2 | UI-DONGLE | PROG2 | Z-DRIVER | 5V | RESET | PROG1 | + | -